# EAGLE board MusselGapeTracker_RevC (EAGLE 7.5.0), part 1 of 2
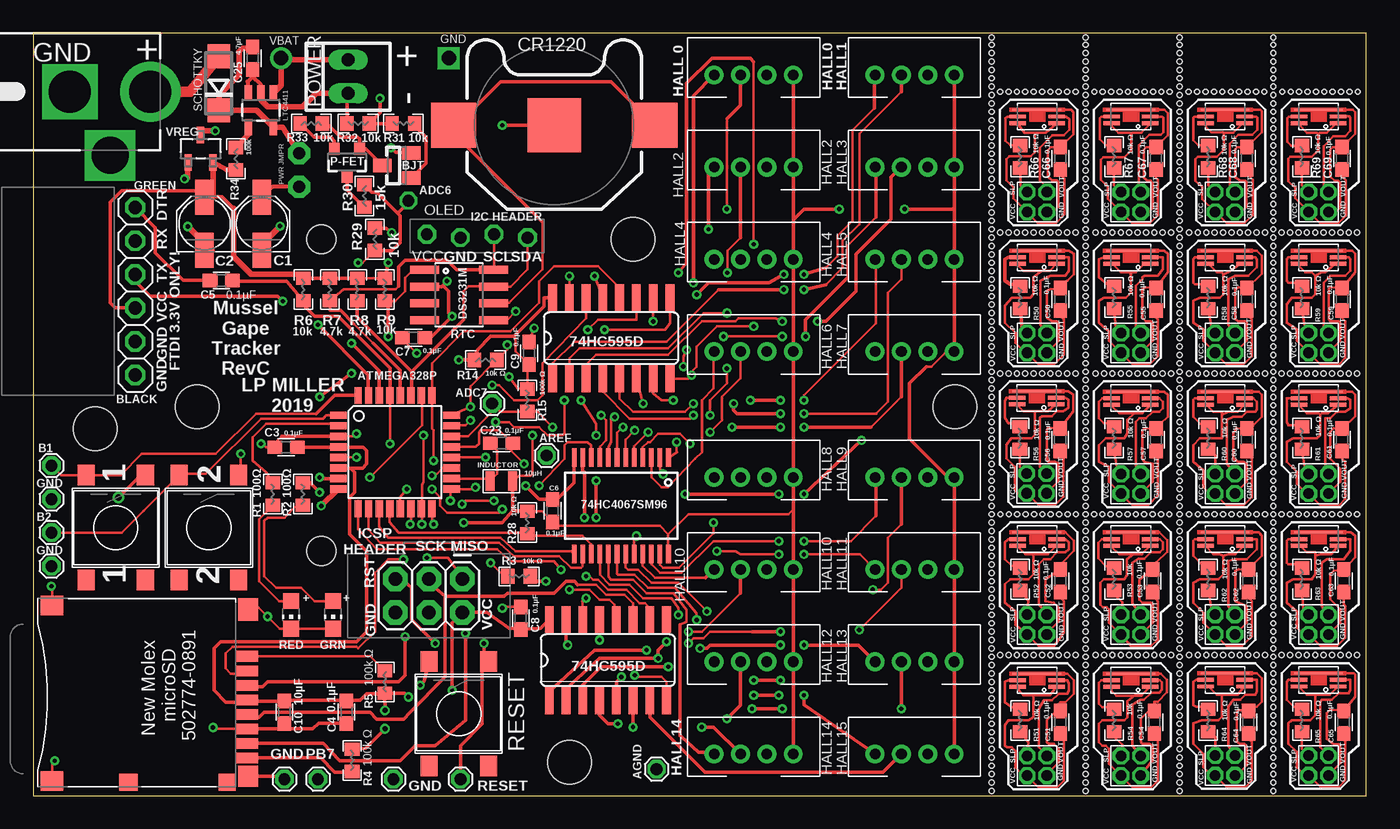
[diagram p1: board, top side]
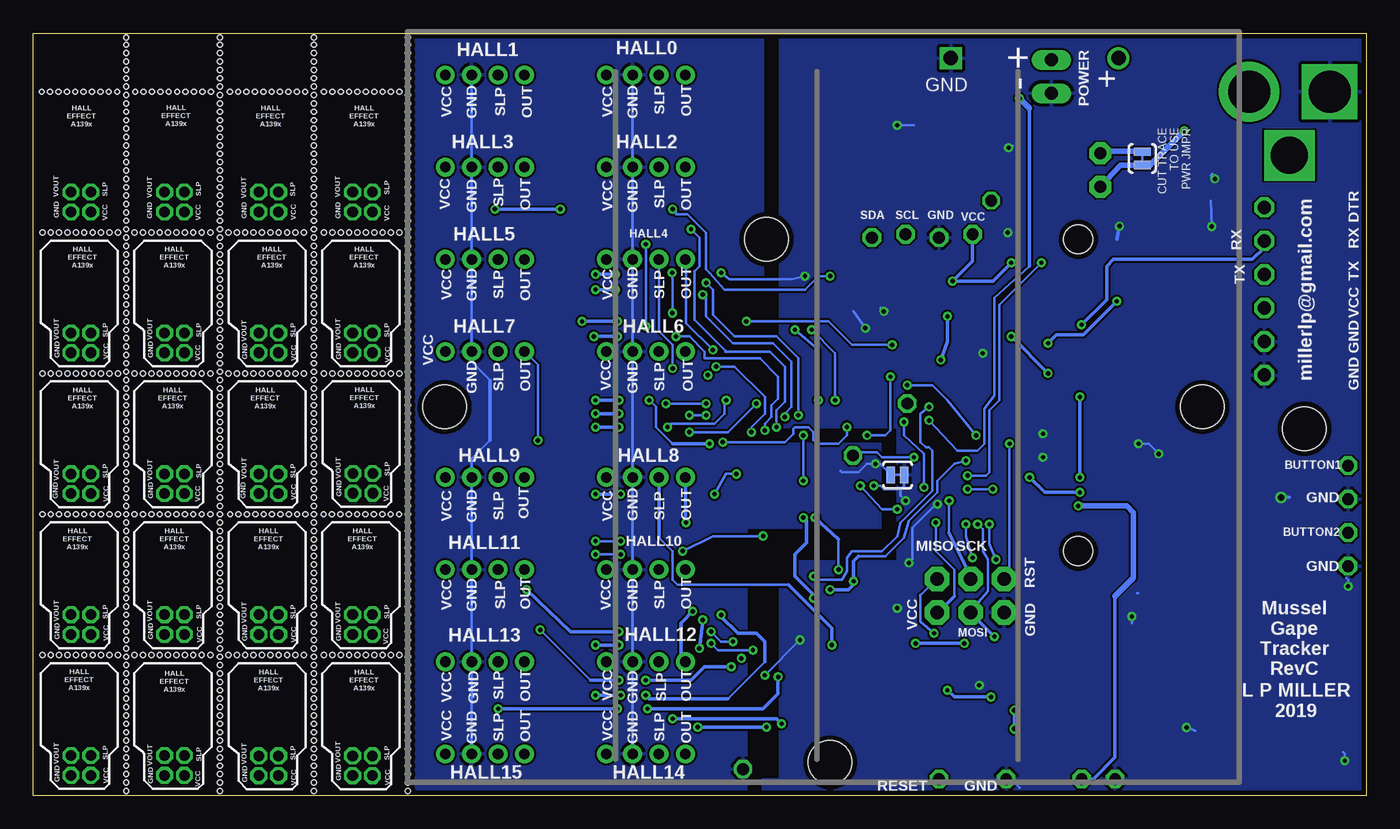
[diagram p2: board, bottom side, seen from below]

Size 101.04 x 57.78 mm. Coordinates in mm from the lower left corner, seen from the top.
Outline: 0,0 101.04,0 101.04,57.78 0,57.78 0,0
Copper layers (1*16): Top 0.0356mm / dielectric 1.5011mm / Bottom 0.0356mm
Design rules "LaenPCBOrder *": minimum track width 6mil, minimum drill 13mil, track to track 6mil, track to pad 6mil, pad to pad 6mil, via to via 6mil, smd to smd 6mil, copper to edge 15mil, drill to drill 6mil, minimum pad ring 7mil, minimum via ring 7mil, stop-mask expansion 3mil, vias tented up to drill 30mil, thermal gap 10mil
Holes 0.38 mm at 72.64,0.38 72.64,1.02 72.64,1.65 72.64,2.29 72.64,2.92 72.64,3.56 72.64,4.19 72.64,4.83 72.64,5.46 72.64,6.1 72.64,6.73 72.64,7.37 72.64,8 72.64,8.64 72.64,9.27 72.64,9.91 72.64,10.54 72.64,11.18 72.64,11.81 72.64,12.45 72.64,13.08 72.64,13.72 72.64,14.35 72.64,14.99 72.64,15.62 72.64,16.26 72.64,16.89 72.64,17.53 72.64,18.16 72.64,18.8 72.64,19.43 72.64,20.07 72.64,20.7 72.64,21.34 72.64,21.97 72.64,22.61 72.64,23.24 72.64,23.88 72.64,24.51 72.64,25.15 72.64,25.78 72.64,26.42 72.64,27.05 72.64,27.69 72.64,28.32 72.64,28.96 72.64,29.59 72.64,30.23 72.64,30.86 72.64,31.5 72.64,32.13 72.64,32.77 72.64,33.4 72.64,34.04 72.64,34.67 72.64,35.31 72.64,35.94 72.64,36.58 72.64,37.21 72.64,37.85 72.64,38.48 72.64,39.12 72.64,39.75 72.64,40.39 72.64,41.02 72.64,41.66 72.64,42.29 72.64,42.93 72.64,43.56 72.64,44.2 72.64,44.83 72.64,45.47 78.99,32 78.36,32 77.72,32 77.09,32 76.45,32 75.82,32 75.18,32 74.55,32 73.91,32 73.28,32 73.28,10.67 73.91,10.67 74.55,10.67 75.18,10.67 75.82,10.67 76.45,10.67 77.09,10.67 77.72,10.67 73.3,21.34 73.94,21.34 74.57,21.34 75.21,21.34 75.84,21.34 76.48,21.34 77.11,21.34 77.75,21.34 78.38,21.34 79.02,21.34 78.36,10.67 78.99,10.67 79.76,0.38 79.76,1.02 79.76,1.65 79.76,2.29 79.76,2.92 79.76,3.56 79.76,4.19 79.76,4.83 79.76,5.46 79.76,6.1 79.76,6.73 79.76,7.37 79.76,8 79.76,8.64 79.76,9.27 79.76,9.91 79.76,10.54 79.76,11.18 79.76,11.81 79.76,12.45 79.76,13.08 79.76,13.72 79.76,14.35 79.76,14.99 79.76,15.62 79.76,16.26 79.76,16.89 79.76,17.53 79.76,18.16 79.76,18.8 79.76,19.43 79.76,20.07 79.76,20.7 79.76,21.34 79.76,21.97 79.76,22.61 79.76,23.24 79.76,23.88 79.76,24.51 79.76,25.15 79.76,25.78 79.76,26.42 79.76,27.05 79.76,27.69 79.76,28.32 79.76,28.96 79.76,29.59 79.76,30.23 79.76,30.86 79.76,31.5 79.76,32.13 79.76,32.77 79.76,33.4 79.76,34.04 79.76,34.67 79.76,35.31 79.76,35.94 79.76,36.58 79.76,37.21 79.76,37.85 79.76,38.48 79.76,39.12 79.76,39.75 79.76,40.39 79.76,41.02 79.76,41.66 79.76,42.29 79.76,42.93 79.76,43.56 79.76,44.2 79.76,44.83 79.76,45.47 80.52,10.67 81.15,10.67 81.79,10.67 82.42,10.67 83.06,10.67 83.69,10.67 84.33,10.67 84.96,10.67 85.6,10.67 86.23,10.67 80.39,21.34 81.03,21.34 81.66,21.34 82.3,21.34 82.93,21.34 83.57,21.34 84.2,21.34 84.84,21.34 85.47,21.34 86.11,21.34 86.23,32 85.6,32 84.96,32 84.33,32 83.69,32 83.06,32 82.42,32 81.79,32 81.15,32 80.52,32 86.87,0.38 86.87,1.02 86.87,1.65 86.87,2.29 86.87,2.92 86.87,3.56 86.87,4.19 86.87,4.83 86.87,5.46 86.87,6.1 86.87,6.73 86.87,7.37 86.87,8 86.87,8.64 86.87,9.27 86.87,9.91 86.87,10.54 86.87,11.18 86.87,11.81 86.87,12.45 86.87,13.08 86.87,13.72 86.87,14.35 86.87,14.99 86.87,15.62 86.87,16.26 86.87,16.89 86.87,17.53 86.87,18.16 86.87,18.8 86.87,19.43 86.87,20.07 86.87,20.7 86.87,21.34 86.87,21.97 86.87,22.61 86.87,23.24 86.87,23.88 86.87,24.51 86.87,25.15 86.87,25.78 86.87,26.42 86.87,27.05 86.87,27.69 86.87,28.32 86.87,28.96 86.87,29.59 86.87,30.23 86.87,30.86 86.87,31.5 86.87,32.13 86.87,32.77 86.87,33.4 86.87,34.04 86.87,34.67 86.87,35.31 86.87,35.94 86.87,36.58 86.87,37.21 86.87,37.85 86.87,38.48 86.87,39.12 86.87,39.75 86.87,40.39 86.87,41.02 86.87,41.66 86.87,42.29 86.87,42.93 86.87,43.56 86.87,44.2 86.87,44.83 86.87,45.47 93.34,32 92.71,32 92.08,32 91.44,32 90.81,32 90.17,32 89.53,32 88.9,32 88.27,32 87.6,32 87.6,10.67 88.27,10.67 88.9,10.67 89.53,10.67 90.17,10.67 90.81,10.67 91.44,10.67 92.08,10.67 87.6,21.34 88.27,21.34 88.9,21.34 89.53,21.34 90.17,21.34 90.81,21.34 91.44,21.34 92.08,21.34 92.71,21.34 93.34,21.34 92.71,10.67 93.34,10.67 93.98,0.38 93.98,1.02 93.98,1.65 93.98,2.29 93.98,2.92 93.98,3.56 93.98,4.19 93.98,4.83 93.98,5.46 93.98,6.1 93.98,6.73 93.98,7.37 93.98,8 93.98,8.64 93.98,9.27 93.98,9.91 93.98,10.54 93.98,11.18 93.98,11.81 93.98,12.45 93.98,13.08 93.98,13.72 93.98,14.35 93.98,14.99 93.98,15.62 93.98,16.26 93.98,16.89 93.98,17.53 93.98,18.16 93.98,18.8 93.98,19.43 93.98,20.07 93.98,20.7 93.98,21.34 93.98,21.97 93.98,22.61 93.98,23.24 93.98,23.88 93.98,24.51 93.98,25.15 93.98,25.78 93.98,26.42 93.98,27.05 93.98,27.69 93.98,28.32 93.98,28.96 93.98,29.59 93.98,30.23 93.98,30.86 93.98,31.5 93.98,32.13 93.98,32.77 93.98,33.4 93.98,34.04 93.98,34.67 93.98,35.31 93.98,35.94 93.98,36.58 93.98,37.21 93.98,37.85 93.98,38.48 93.98,39.12 93.98,39.75 93.98,40.39 93.98,41.02 93.98,41.66 93.98,42.29 93.98,42.93 93.98,43.56 93.98,44.2 93.98,44.83 93.98,45.47 94.61,10.67 95.25,10.67 95.89,10.67 96.52,10.67 97.16,10.67 97.79,10.67 98.42,10.67 99.06,10.67 99.69,10.67 100.33,10.67 94.61,21.34 95.25,21.34 95.89,21.34 96.52,21.34 97.16,21.34 97.79,21.34 98.42,21.34 99.06,21.34 99.69,21.34 100.33,21.34 100.33,32 99.69,32 99.06,32 98.42,32 97.79,32 97.16,32 96.52,32 95.89,32 95.25,32 94.61,32 72.64,46.1 72.64,46.74 72.64,47.37 72.64,48.01 72.64,48.64 72.64,49.28 72.64,49.91 72.64,50.55 72.64,51.18 72.64,51.82 72.64,52.45 72.64,53.09 72.64,53.72 72.64,54.36 72.64,54.99 72.64,55.63 72.64,56.26 72.64,56.9 78.99,42.67 78.36,42.67 77.72,42.67 77.09,42.67 76.45,42.67 75.82,42.67 75.18,42.67 74.55,42.67 73.91,42.67 73.28,42.67 79.76,46.1 79.76,46.74 79.76,47.37 79.76,48.01 79.76,48.64 79.76,49.28 79.76,49.91 79.76,50.55 79.76,51.18 79.76,51.82 79.76,52.45 79.76,53.09 79.76,53.72 79.76,54.36 79.76,54.99 79.76,55.63 79.76,56.26 79.76,56.9 86.23,42.67 85.6,42.67 84.96,42.67 84.33,42.67 83.69,42.67 83.06,42.67 82.42,42.67 81.79,42.67 81.15,42.67 80.52,42.67 86.87,46.1 86.87,46.74 86.87,47.37 86.87,48.01 86.87,48.64 86.87,49.28 86.87,49.91 86.87,50.55 86.87,51.18 86.87,51.82 86.87,52.45 86.87,53.09 86.87,53.72 86.87,54.36 86.87,54.99 86.87,55.63 86.87,56.26 86.87,56.9 93.34,42.67 92.71,42.67 92.08,42.67 91.44,42.67 90.81,42.67 90.17,42.67 89.53,42.67 88.9,42.67 88.27,42.67 87.6,42.67 93.98,46.1 93.98,46.74 93.98,47.37 93.98,48.01 93.98,48.64 93.98,49.28 93.98,49.91 93.98,50.55 93.98,51.18 93.98,51.82 93.98,52.45 93.98,53.09 93.98,53.72 93.98,54.36 93.98,54.99 93.98,55.63 93.98,56.26 93.98,56.9 100.33,42.67 99.69,42.67 99.06,42.67 98.42,42.67 97.79,42.67 97.16,42.67 96.52,42.67 95.89,42.67 95.25,42.67 94.61,42.67 78.99,53.34 78.36,53.34 77.72,53.34 77.09,53.34 76.45,53.34 75.82,53.34 75.18,53.34 74.55,53.34 73.91,53.34 73.28,53.34 86.13,53.34 85.5,53.34 84.86,53.34 84.23,53.34 83.59,53.34 82.96,53.34 82.32,53.34 81.69,53.34 81.05,53.34 80.42,53.34 93.29,53.34 92.66,53.34 92.02,53.34 91.39,53.34 90.75,53.34 90.12,53.34 89.48,53.34 88.85,53.34 88.21,53.34 87.55,53.34 100.38,53.34 99.75,53.34 99.11,53.34 98.48,53.34 97.84,53.34 97.21,53.34 96.57,53.34 95.94,53.34 95.3,53.34 94.67,53.34 72.64,57.45 79.76,57.45 86.87,57.45 93.98,57.45

## Footprints (pad centres in the part's own frame; a part is rotated, then mirrored left to right if it is on the bottom)
PUSHBUTTON_DPST_SMD = smd 1.55 x 1.3: P 3.975,-2.25; P$1 -3.975,-2.25; S 3.975,2.25; S$1 -3.975,2.25
POWER_JACK_DC_2,1MM = drill 3.175 pad 4.572: P$1 0,0 | drill 3.175 square: P$2 6.096,0 | drill 2.8 square: P$3 3.048,4.826
A139*_HALL_EFFECT = smd 0.3 x 1.25: P$1 -0.5,-1.475; P$2 0,-1.475; P$5 0,1.475; P$6 -0.5,1.475 | smd 0.15 x 3.7: P$3_4 0.5,0
SOT23 = smd 1 x 1.4: 1 -0.95,-1.1; 2 0.95,-1.1; 3 0,1.1
PANASONIC_B = smd 2.667 x 1.4: + 2.006,0; - -2.006,0
0603 = smd 1.1 x 1: 1 -0.85,0; 2 0.85,0
CR1220_BATTERY_HOLDER_SMD = smd 4.064 x 4.064: GND 0,0 | smd 3.429 x 3.429: P$1 -7.62,0; P$2 7.62,0
DS3231M_SOIC8 = smd 0.61 x 2.21: 1 -1.905,-2.616; 2 -0.635,-2.616; 3 0.635,-2.616; 4 1.905,-2.616; 5 1.905,2.616; 6 0.635,2.616; 7 -0.635,2.616; 8 -1.905,2.616
1X01_SMALL = drill 0.9 pad 1.397 octagon: 1 0,0
SJ_2S-TRACE = smd 0.635 x 1.27: 1 -0.508,0; 2 0.508,0
JST-PH-4-THM = drill 0.8 pad 1.422: 1 3,0; 2 1,0; 3 -1,0; 4 -3,0
2X2_1.5MM = drill 0.8 pad 1.27 octagon: P$1 -0.75,0.75; P$2 0.75,0.75; P$3 -0.75,-0.75; P$4 0.75,-0.75
I_0805 = smd 0.7 x 1.45: P$1 -0.85,0; P$2 0.85,0
2X3 = drill 1.016 pad 1.88 octagon: 1 -2.54,0; 2 -2.54,2.54; 3 0,0; 4 0,2.54; 5 2.54,0; 6 2.54,2.54
1X06-RIGHT_ANGLE = drill 1.016 octagon: 1 0,0; 2 2.54,0; 3 5.08,0; 4 7.62,0; 5 10.16,0; 6 12.7,0
CHIPLED_0805 = smd 1.2 x 1.2: A 0,-1.05; C 0,1.05
TSOT-23_5-LEAD = smd 0.55 x 1.2: 1 -0.95,-1.3; 2 0,-1.3; 3 0.95,-1.3; 4 0.95,1.3; 5 -0.95,1.3
SOT95P237X112-3N = smd 0.559 x 1.27: 1 -0.94,-1.041; 2 0.94,-1.041; 3 0,1.041
22-23-2021 = drill 1 long: 1 -1.27,0; 2 1.27,0
1X04_LOCK = drill 0.9 pad 1.422 octagon: 1 -3.81,0.127; 2 -1.27,-0.127; 3 1.27,0.127; 4 3.81,-0.127
SOT23-3 = smd 0.8 x 0.9: 1 -0.95,-1; 2 0.95,-1; 3 0,1.1
BATTERY_4XAA_PTH = drill 1.1 square: GND 26.416,19.05 | drill 1.1: VBAT 26.416,6.35 | hole 3.302: 0,0; 0,57.404
1X02_NOSILK = drill 0.9 pad 1.676 octagon: 1 -1.27,0; 2 1.27,0
R0603 = smd 1 x 1.1: 1 -0.85,0; 2 0.85,0
DO214AC = smd 1.8 x 1.7: A 2.05,0; C -2.05,0
SO16 = smd 0.66 x 2.032: 1 -4.445,-3.073; 2 -3.175,-3.073; 3 -1.905,-3.073; 4 -0.635,-3.073; 5 0.635,-3.073; 6 1.905,-3.073; 7 3.175,-3.073; 8 4.445,-3.073; 9 4.445,3.073; 10 3.175,3.073; 11 1.905,3.073; 12 0.635,3.073; 13 -0.635,3.073; 14 -1.905,3.073; 15 -3.175,3.073; 16 -4.445,3.073
STAND-OFF = hole 3.302: 0,0
STAND-OFF_M2 = hole 2.2: 0,0
TQFP32-08 = smd 1.27 x 0.559: 1 -4.293,2.8; 2 -4.293,2; 3 -4.293,1.2; 4 -4.293,0.4; 5 -4.293,-0.4; 6 -4.293,-1.2; 7 -4.293,-2; 8 -4.293,-2.8; 17 4.293,-2.8; 18 4.293,-2; 19 4.293,-1.2; 20 4.293,-0.4; 21 4.293,0.4; 22 4.293,1.2; 23 4.293,2; 24 4.293,2.8 | smd 0.559 x 1.27: 9 -2.8,-4.293; 10 -2,-4.293; 11 -1.2,-4.293; 12 -0.4,-4.293; 13 0.4,-4.293; 14 1.2,-4.293; 15 2,-4.293; 16 2.8,-4.293; 25 2.8,4.293; 26 2,4.293; 27 1.2,4.293; 28 0.4,4.293; 29 -0.4,4.293; 30 -1.2,4.293; 31 -2,4.293; 32 -2.8,4.293
MICROSD_SOCKET_MOLEX_REVERSEMOUNT = smd 1.29 x 1.4: CARD_DETECT1 -0.645,8.12 | smd 1.29 x 1.3: CARD_DETECT2 -0.645,0.65 | smd 0.8 x 1.68: CS2 7.8,-0.84; GND6 3.4,-0.84; MISO7 2.3,-0.84; MOSI3 6.7,-0.84; NC1 8.9,-0.84; RES8 1.2,-0.84; SCK5 4.5,-0.84; VDD4 5.6,-0.84 | smd 1.6 x 1.5: MNT1 -0.2,-0.93 | smd 1.7 x 1.5: MNT2 12.45,-0.93 | smd 1.5 x 1.7: MNT3 -0.54,13.92; MNT4 12.75,13.92
SSOP24 = smd 0.348 x 1.397: 1 -3.575,-3.656; 2 -2.925,-3.656; 3 -2.275,-3.656; 4 -1.625,-3.656; 5 -0.975,-3.656; 6 -0.325,-3.656; 7 0.325,-3.656; 8 0.975,-3.656; 9 1.625,-3.656; 10 2.275,-3.656; 11 2.925,-3.656; 12 3.575,-3.656; 13 3.575,3.656; 14 2.925,3.656; 15 2.275,3.656; 16 1.625,3.656; 17 0.975,3.656; 18 0.325,3.656; 19 -0.325,3.656; 20 -0.975,3.656; 21 -1.625,3.656; 22 -2.275,3.656; 23 -2.925,3.656; 24 -3.575,3.656

## Placement (x,y rotation side)
1  PUSHBUTTON_DPST_SMDSTANDARD  [PUSHBUTTON_DPST_SMD]  6.27,20.32 270 top
2  PUSHBUTTON_DPST_SMDSTANDARD  [PUSHBUTTON_DPST_SMD]  13.34,20.32 270 top
2,1MM_JACK  POWER_JACK_2,1MM  [POWER_JACK_DC_2,1MM]  8.89,53.34 180 top
A139_HALL0  HALL_EFFECT_ALLEGRO_A139MLP/DFN-6  [A139*_HALL_EFFECT]  76.07,40.79 90 top
A139_HALL1  HALL_EFFECT_ALLEGRO_A139MLP/DFN-6  [A139*_HALL_EFFECT]  76.07,8.76 90 top
A139_HALL2  HALL_EFFECT_ALLEGRO_A139MLP/DFN-6  [A139*_HALL_EFFECT]  76.07,19.46 90 top
A139_HALL3  HALL_EFFECT_ALLEGRO_A139MLP/DFN-6  [A139*_HALL_EFFECT]  83.19,19.46 90 top
A139_HALL4  HALL_EFFECT_ALLEGRO_A139MLP/DFN-6  [A139*_HALL_EFFECT]  83.19,8.76 90 top
A139_HALL5  HALL_EFFECT_ALLEGRO_A139MLP/DFN-6  [A139*_HALL_EFFECT]  83.19,40.79 90 top
A139_HALL6  HALL_EFFECT_ALLEGRO_A139MLP/DFN-6  [A139*_HALL_EFFECT]  76.05,30.15 90 top
A139_HALL7  HALL_EFFECT_ALLEGRO_A139MLP/DFN-6  [A139*_HALL_EFFECT]  83.19,30.12 90 top
A139_HALL8  HALL_EFFECT_ALLEGRO_A139MLP/DFN-6  [A139*_HALL_EFFECT]  90.32,40.79 90 top
A139_HALL9  HALL_EFFECT_ALLEGRO_A139MLP/DFN-6  [A139*_HALL_EFFECT]  97.41,40.79 90 top
A139_HALL10  HALL_EFFECT_ALLEGRO_A139MLP/DFN-6  [A139*_HALL_EFFECT]  90.32,30.12 90 top
A139_HALL11  HALL_EFFECT_ALLEGRO_A139MLP/DFN-6  [A139*_HALL_EFFECT]  97.41,30.12 90 top
A139_HALL12  HALL_EFFECT_ALLEGRO_A139MLP/DFN-6  [A139*_HALL_EFFECT]  90.32,19.46 90 top
A139_HALL13  HALL_EFFECT_ALLEGRO_A139MLP/DFN-6  [A139*_HALL_EFFECT]  97.41,19.46 90 top
A139_HALL14  HALL_EFFECT_ALLEGRO_A139MLP/DFN-6  [A139*_HALL_EFFECT]  90.32,8.79 90 top
A139_HALL15  HALL_EFFECT_ALLEGRO_A139MLP/DFN-6  [A139*_HALL_EFFECT]  97.41,8.79 90 top
A139_HALL16  HALL_EFFECT_ALLEGRO_A139MLP/DFN-6  [A139*_HALL_EFFECT]  76.07,51.46 90 top
A139_HALL17  HALL_EFFECT_ALLEGRO_A139MLP/DFN-6  [A139*_HALL_EFFECT]  83.19,51.46 90 top
A139_HALL18  HALL_EFFECT_ALLEGRO_A139MLP/DFN-6  [A139*_HALL_EFFECT]  90.32,51.46 90 top
A139_HALL19  HALL_EFFECT_ALLEGRO_A139MLP/DFN-6  [A139*_HALL_EFFECT]  97.41,51.46 90 top
BJT  KSC1623_BJT_TRANSISTOR  [SOT23]  27.56,47.75 90 top
C1  1µF  [PANASONIC_B]  17.35,43.33 90 top
C2  1µF  [PANASONIC_B]  13,43.33 90 top
C3  0.1µF  [0603]  19.18,26.42 180 top
C4  0.1µF  [0603]  23.75,6.35 270 top
C5  0.1µF  [0603]  14.27,39.04 0 top
C6  0.1µF  [0603]  39.37,21.59 90 top
C7  0.1µF  [0603]  28.83,34.7 180 top
C8  0.1µF  [0603]  36.96,13.46 90 top
C9  0.1µF  [0603]  37.59,33.53 90 top
C10  10µF  [0603]  19.05,6.35 270 top
C23  0.1µF  [0603]  35.51,26.72 0 top
C25  4.7µF  [0603]  16.64,55.88 270 top
C50  0.1µF  [0603]  77.85,37.62 90 top
C51  0.1µF  [0603]  77.85,5.59 90 top
C52  0.1µF  [0603]  77.85,16.28 90 top
C53  0.1µF  [0603]  84.84,16.28 90 top
C54  0.1µF  [0603]  84.96,5.59 90 top
C55  0.1µF  [0603]  85.09,37.62 90 top
C56  0.1µF  [0603]  77.83,26.97 90 top
C57  0.1µF  [0603]  85.09,26.97 90 top
C58  0.1µF  [0603]  91.97,37.62 90 top
C59  0.1µF  [0603]  99.19,37.62 90 top
C60  0.1µF  [0603]  91.97,26.97 90 top
C61  0.1µF  [0603]  99.19,26.97 90 top
C62  0.1µF  [0603]  92.1,16.28 90 top
C63  0.1µF  [0603]  99.31,16.28 90 top
C64  0.1µF  [0603]  92.1,5.59 90 top
C65  0.1µF  [0603]  99.31,5.59 90 top
C66  0.1µF  [0603]  77.85,48.29 90 top
C67  0.1µF  [0603]  85.09,48.29 90 top
C68  0.1µF  [0603]  91.97,48.29 90 top
C69  0.1µF  [0603]  99.19,48.29 90 top
CR1220_BATTERY  CR1220_BATTERY_HOLDERSMD  [CR1220_BATTERY_HOLDER_SMD]  39.5,50.8 0 top
DS3231M  DS3231MSOIC-8  [DS3231M_SOIC8]  32.28,37.95 270 top
GND  PINHD-1X1SMALL  [1X01_SMALL]  19.05,1.27 0 top
GROUND_CON  SOLDER_JUMPER_TRACESTANDARD  [SJ_2S-TRACE]  35.53,24.31 180 bottom
HALL0  JST-4PINTH_STRAIGHT  [JST-PH-4-THM]  54.61,54.61 0 top
HALL0_HEADER  PINHD-2X21.5MM_SILK  [2X2_1.5MM]  76.07,34.32 180 top
HALL1  JST-4PINTH_STRAIGHT  [JST-PH-4-THM]  66.8,54.61 0 top
HALL1_HEADER  PINHD-2X21.5MM_SILK  [2X2_1.5MM]  76.07,2.29 180 top
HALL2  JST-4PINTH_STRAIGHT  [JST-PH-4-THM]  54.61,47.62 0 top
HALL2_HEADER  PINHD-2X21.5MM_SILK  [2X2_1.5MM]  76.07,12.98 180 top
HALL3  JST-4PINTH_STRAIGHT  [JST-PH-4-THM]  66.8,47.62 0 top
HALL3_HEADER  PINHD-2X21.5MM_SILK  [2X2_1.5MM]  83.19,12.98 180 top
HALL4  JST-4PINTH_STRAIGHT  [JST-PH-4-THM]  54.61,40.64 0 top
HALL4_HEADER  PINHD-2X21.5MM_SILK  [2X2_1.5MM]  83.19,2.29 180 top
HALL5  JST-4PINTH_STRAIGHT  [JST-PH-4-THM]  66.8,40.64 0 top
HALL5_HEADER  PINHD-2X21.5MM_SILK  [2X2_1.5MM]  83.19,34.32 180 top
HALL6  JST-4PINTH_STRAIGHT  [JST-PH-4-THM]  54.61,33.66 0 top
HALL6_HEADER  PINHD-2X21.5MM_SILK  [2X2_1.5MM]  76.05,23.67 180 top
HALL7  JST-4PINTH_STRAIGHT  [JST-PH-4-THM]  66.8,33.66 0 top
HALL7_HEADER  PINHD-2X21.5MM_SILK  [2X2_1.5MM]  83.19,23.65 180 top
HALL8  JST-4PINTH_STRAIGHT  [JST-PH-4-THM]  54.61,24.13 0 top
HALL8_HEADER  PINHD-2X21.5MM_SILK  [2X2_1.5MM]  90.32,34.32 180 top
HALL9  JST-4PINTH_STRAIGHT  [JST-PH-4-THM]  66.8,24.13 0 top
HALL9_HEADER  PINHD-2X21.5MM_SILK  [2X2_1.5MM]  97.41,34.32 180 top
HALL10  JST-4PINTH_STRAIGHT  [JST-PH-4-THM]  54.61,17.14 0 top
HALL10_HEADER  PINHD-2X21.5MM_SILK  [2X2_1.5MM]  90.32,23.65 180 top
HALL11  JST-4PINTH_STRAIGHT  [JST-PH-4-THM]  66.8,17.14 0 top
HALL11_HEADER  PINHD-2X21.5MM_SILK  [2X2_1.5MM]  97.41,23.65 180 top
HALL12  JST-4PINTH_STRAIGHT  [JST-PH-4-THM]  54.61,10.16 0 top
HALL12_HEADER  PINHD-2X21.5MM_SILK  [2X2_1.5MM]  90.32,12.98 180 top
HALL13  JST-4PINTH_STRAIGHT  [JST-PH-4-THM]  66.8,10.16 0 top
HALL13_HEADER  PINHD-2X21.5MM_SILK  [2X2_1.5MM]  97.41,12.98 180 top
HALL14  JST-4PINTH_STRAIGHT  [JST-PH-4-THM]  54.61,3.17 0 top
HALL14_HEADER  PINHD-2X21.5MM_SILK  [2X2_1.5MM]  90.32,2.31 180 top
HALL15  JST-4PINTH_STRAIGHT  [JST-PH-4-THM]  66.8,3.17 0 top
HALL15_HEADER  PINHD-2X21.5MM_SILK  [2X2_1.5MM]  97.41,2.31 180 top
HALL16_HEADER  PINHD-2X21.5MM_SILK  [2X2_1.5MM]  76.07,44.98 180 top
HALL17_HEADER  PINHD-2X21.5MM_SILK  [2X2_1.5MM]  83.19,44.98 180 top
HALL18_HEADER  PINHD-2X21.5MM_SILK  [2X2_1.5MM]  90.32,44.98 180 top
HALL19_HEADER  PINHD-2X21.5MM_SILK  [2X2_1.5MM]  97.41,44.98 180 top
INDUCTOR  10µH  [I_0805]  35.48,23.85 0 top
J1  AVR_SPI_PRG_6PTH  [2X3]  30,16.43 180 top
JP1  FTDI_HEADER  [1X06-RIGHT_ANGLE]  7.75,31.88 90 top
LED1  RED_LED  [CHIPLED_0805]  19.56,13.72 180 top
LED2  GREEN_LED  [CHIPLED_0805]  22.73,13.72 180 top
LTC4411  LTC4411TSOT-23_5-LEAD  [TSOT-23_5-LEAD]  17.27,51.94 180 top
MCP1700T-3302  MCP1700T-3302E/TT  [SOT95P237X112-3N]  12.7,49.02 0 top
MOLEX_KK  22-23-2021  [22-23-2021]  23.88,54.48 90 top
OLED  PINHD-1X4LOCK  [1X04_LOCK]  33.66,42.42 0 top
P-FET  MOSFET-PCHANNELBSH203  [SOT23-3]  23.8,48.01 180 top
PB7  PINHD-1X1SMALL  [1X01_SMALL]  21.59,1.27 0 top
PRIMARY_BATTERY  BATTERY_4XAA  [BATTERY_4XAA_PTH]  12.45,29.46 90 bottom
PWR_JUMPER  PWR_JMPR  [1X02_NOSILK]  20.17,47.4 90 top
PWR_PASSTHRU  PWR  [SJ_2S-TRACE]  16.99,48.29 90 bottom
R1  100 Ω  [R0603]  18.16,22.86 90 top
R2  100 Ω  [R0603]  20.45,22.86 90 top
R3  10k Ω  [R0603]  36.83,16.64 0 top
R4  100k Ω  [R0603]  24.18,2.69 90 top
R5  100k Ω  [R0603]  26.64,8.64 270 top
R6  10k Ω  [R0603]  20.47,38.35 90 top
R7  10k Ω  [R0603]  22.5,38.35 90 top
R8  10k Ω  [R0603]  24.56,38.35 90 top
R9  10k Ω  [R0603]  26.67,38.35 90 top
R14  10k Ω  [R0603]  34.29,33.02 180 top
R15  100k Ω  [R0603]  37.47,29.97 90 top
R28  10k Ω  [R0603]  37.47,20.7 90 top
R29  10k  [R0603]  25.91,42.16 270 top
R30  15k  [R0603]  25.1,45.44 270 top
R31  10k  [R0603]  28.07,50.93 0 top
R32  10k  [R0603]  24.64,50.93 0 top
R33  10k  [R0603]  21.08,50.93 180 top
R34  100k  [R0603]  15.37,48.26 270 top
R50  10k Ω  [R0603]  74.8,37.74 90 top
R51  10k Ω  [R0603]  74.8,5.71 90 top
R52  10k Ω  [R0603]  74.8,16.41 90 top
R53  10k Ω  [R0603]  81.92,16.41 90 top
R54  10k Ω  [R0603]  81.92,5.71 90 top
R55  10k Ω  [R0603]  81.92,37.74 90 top
R56  10k Ω  [R0603]  74.78,27.1 90 top
R57  10k Ω  [R0603]  81.92,27.1 90 top
R58  10k Ω  [R0603]  89.05,37.74 90 top
R59  10k Ω  [R0603]  96.14,37.74 90 top
R60  10k Ω  [R0603]  89.05,27.1 90 top
R61  10k Ω  [R0603]  96.14,27.1 90 top
R62  10k Ω  [R0603]  89.05,16.41 90 top
R63  10k Ω  [R0603]  96.14,16.41 90 top
R64  10k Ω  [R0603]  89.05,5.71 90 top
R65  10k Ω  [R0603]  96.14,5.71 90 top
R66  10k Ω  [R0603]  74.8,48.41 90 top
R67  10k Ω  [R0603]  81.92,48.41 90 top
R68  10k Ω  [R0603]  89.05,48.41 90 top
R69  10k Ω  [R0603]  96.14,48.41 90 top
RESET  PUSHBUTTON_DPST_SMDSTANDARD  [PUSHBUTTON_DPST_SMD]  32.26,6.22 270 top
SCHOTTKY  SCHOTTKY_DIODE_DO-214AC  [DO214AC]  14.1,53.98 90 top
SHIFT_0  74HC595D  [SO16]  43.81,34.67 0 top
SHIFT_1  74HC595D  [SO16]  43.56,10.29 0 top
STANDOFF1  STAND-OFF4-40  [STAND-OFF]  45.47,42.16 0 top
STANDOFF2  STAND-OFF4-40  [STAND-OFF]  4.7,27.81 0 top
STANDOFF3  STAND-OFF4-40  [STAND-OFF]  40.64,2.54 0 top
STANDOFF4_M2  STAND-OFFM2  [STAND-OFF_M2]  21.84,18.54 0 top
STANDOFF5_M2  STAND-OFFM2  [STAND-OFF_M2]  21.84,42.16 0 top
U1  ATMEGA328P  [TQFP32-08]  27.43,26.04 0 top
U$1  MICROSD_MOLEX_REVERSECURRENT  [MICROSD_SOCKET_MOLEX_REVERSEMOUNT]  15.37,1.68 90 top
U$2  74HC4067SM96  [SSOP24]  44.58,21.97 180 top
U$3  PINHD-1X1SMALL  [1X01_SMALL]  32.38,1.27 0 top
U$4  PINHD-1X1SMALL  [1X01_SMALL]  27.3,1.27 0 top
U$6  PINHD-1X1SMALL  [1X01_SMALL]  1.4,25.02 0 top
U$7  PINHD-1X1SMALL  [1X01_SMALL]  1.4,22.48 0 top
U$8  PINHD-1X1SMALL  [1X01_SMALL]  1.4,19.94 0 top
U$9  PINHD-1X1SMALL  [1X01_SMALL]  1.4,17.4 0 top
U$10  PINHD-1X1SMALL  [1X01_SMALL]  34.8,29.72 0 top
U$11  PINHD-1X1SMALL  [1X01_SMALL]  47.24,2.03 0 top
U$17  PINHD-1X1SMALL  [1X01_SMALL]  38.91,25.78 0 top